# EAGLE schematic SensorStick_IMUedits (EAGLE 9.6.2)
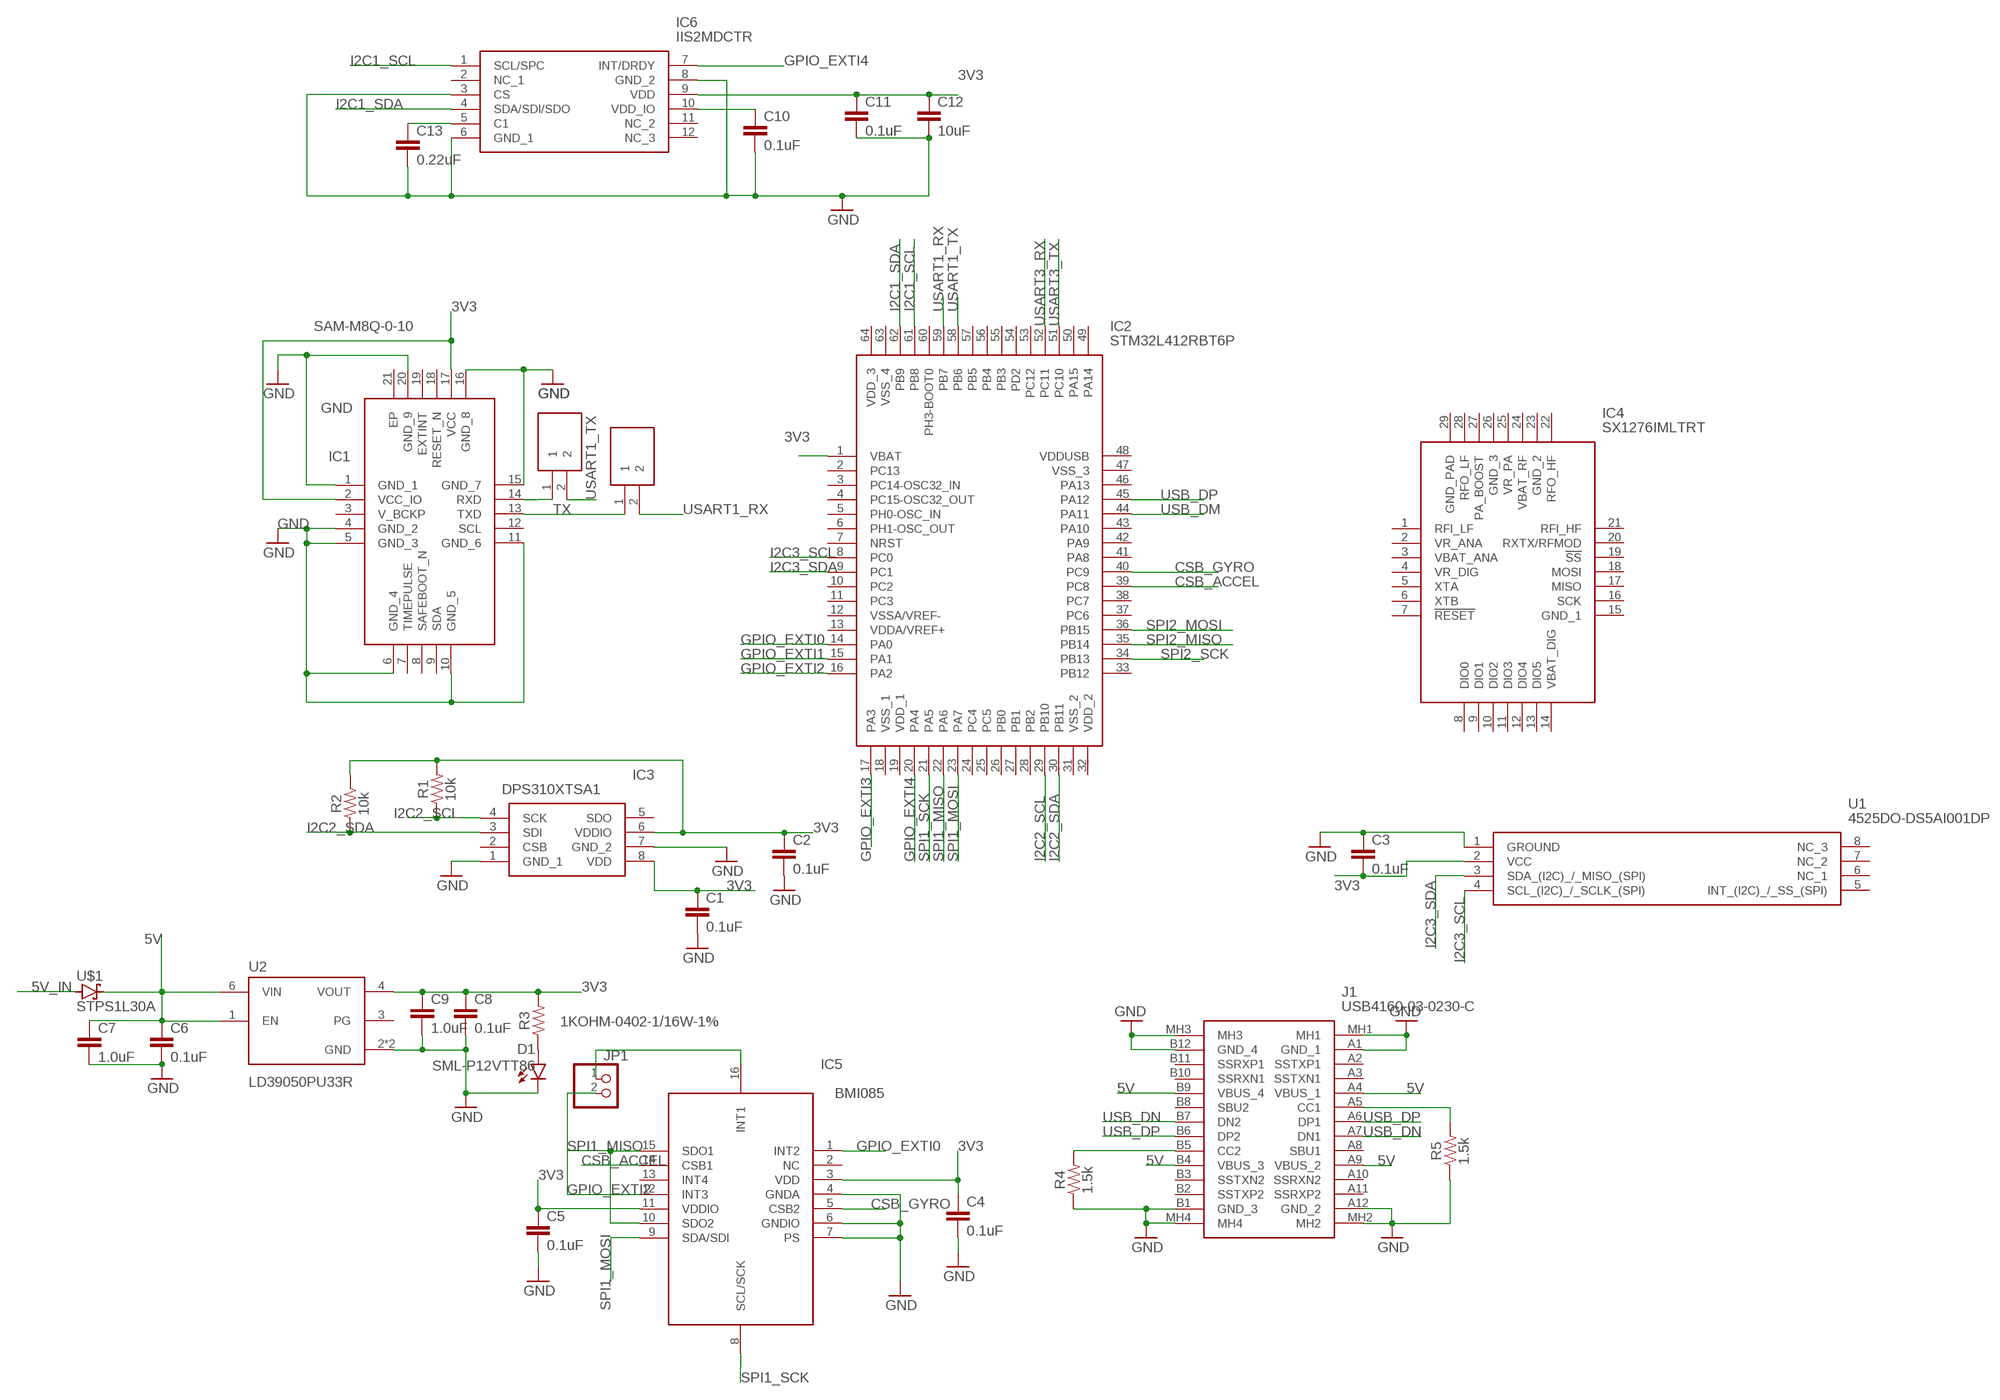
[diagram p0: schematic, sheet 1]

## Parts
C1  0.1uF  0.1UF-0402-6.3V-10%-X7R  [0402]
C2  0.1uF  0.1UF-0402-6.3V-10%-X7R  [0402]
C3  0.1uF  0.1UF-0402-6.3V-10%-X7R  [0402]
C4  0.1uF  0.1UF-0402-6.3V-10%-X7R  [0402]
C5  0.1uF  0.1UF-0402-6.3V-10%-X7R  [0402]
C6  0.1uF  0.1UF-0402-6.3V-10%-X7R  [0402]
C7  1.0uF  1.0UF-0402-16V-10%  [0402]
C8  0.1uF  0.1UF-0402-6.3V-10%-X7R  [0402]
C9  1.0uF  1.0UF-0402-16V-10%  [0402]
C10  0.1uF  0.1UF-0402-6.3V-10%-X7R  [0402]
C11  0.1uF  0.1UF-0402-6.3V-10%-X7R  [0402]
C12  10uF  10UF-0603-6.3V-20%  [0603]
C13  0.22uF  0.22UF-0603-25V-10%  [0603]
D1  SML-P12VTT86  [LED_SML-P11UTT86R]
FB1  BLM15HD102SN1  [NFZ15SG152SN10B]
FB2  BLM15HD102SN1  [NFZ15SG152SN10B]
IC1  SAM-M8Q-0-10  [SAMM8Q010]
IC2  STM32L412RBT6P  [QFP50P1200X1200X160-64N]
IC3  DPS310XTSA1  [DPS310XTSA1]
IC4  SX1276IMLTRT  [QFN65P600X600X100-29N]
IC5  BMI085  [BMI085]
IC6  IIS2MDCTR  [IIS2MDCTR]
J1  USB4160-03-0230-C  [USB4160030230C]
JP1  PINHD-1X2  [1X02]
R1  10k  10KOHM-0402-1/16W-1%  [0402]
R2  10k  10KOHM-0402-1/16W-1%  [0402]
R3  1KOHM-0402-1/16W-1%  [0402]
R4  1.5k  1.5KOHM-0603-1/10W-1%  [0603]
R5  1.5k  1.5KOHM-0603-1/10W-1%  [0603]
U1  4525DO-DS5AI001DP  [4525DO-DS...P]
U2  LD39050PU33R  [SON95P300X300X100-7N]
U$1  STPS1L30A  [DIOM5226X223N]

## Nets
3V3: C1.1 C2.1 C3.2 C4.1 C5.1 C8.1 C9.1 C11.1 C12.1 IC1.2(VCC_IO) IC1.17(VCC) IC2.1(VBAT) IC3.6(VDDIO) IC3.8(VDD) IC5.3(VDD) IC5.11(VDDIO) IC6.9(VDD) R1.2 R2.2 R3.2 U1.2(VCC) U2.4(VOUT)
5V: C6.1 C7.1 J1.A4(VBUS_1) J1.A9(VBUS_2) J1.B4(VBUS_3) J1.B9(VBUS_4) U2.1(EN) U2.6(VIN) U$1.1(C)
5V_IN: U$1.2(A)
CSB_ACCEL: IC2.39(PC8) IC5.14(CSB1)
CSB_GYRO: IC2.40(PC9) IC5.5(CSB2)
GND: C1.2 C2.2 C3.1 C4.2 C5.2 C6.2 C7.2 C8.2 C9.2 C10.2 C11.2 C12.2 C13.2 D1.C IC1.1(GND_1) IC1.4(GND_2) IC1.5(GND_3) IC1.6(GND_4) IC1.10(GND_5) IC1.11(GND_6) IC1.15(GND_7) IC1.16(GND_8) IC1.20(GND_9) IC3.1(GND_1) IC3.7(GND_2) IC5.4(GNDA) IC5.6(GNDIO) IC5.7(PS) IC6.3(CS) IC6.6(GND_1) IC6.8(GND_2) J1.A1(GND_1) J1.A12(GND_2) J1.B1(GND_3) J1.B12(GND_4) J1.MH1 J1.MH2 J1.MH3 J1.MH4 R4.1 R5.1 U1.1(GROUND) U2.2(GND) U2.7(GND)
GPIO_EXTI0: IC2.14(PA0) IC5.1(INT2)
GPIO_EXTI1: IC2.15(PA1)
GPIO_EXTI2: IC2.16(PA2) IC5.12(INT3) JP1.2
GPIO_EXTI3: IC2.17(PA3)
GPIO_EXTI4: IC2.20(PA4) IC6.7(INT/DRDY)
I2C1_SCL: IC2.61(PB8) IC6.1(SCL/SPC)
I2C1_SDA: IC2.62(PB9) IC6.4(SDA/SDI/SDO)
I2C2_SCL: IC2.29(PB10) IC3.4(SCK) R1.1
I2C2_SDA: IC2.30(PB11) IC3.3(SDI) R2.1
I2C3_SCL: IC2.8(PC0) U1.4(SCL_(I2C)_/_SCLK_(SPI))
I2C3_SDA: IC2.9(PC1) U1.3(SDA_(I2C)_/_MISO_(SPI))
N$2: FB2.1 IC1.14(RXD)
N$3: J1.A5(CC1) R5.2
N$5: D1.A R3.1
N$6: C10.1 IC6.10(VDD_IO)
N$7: C13.1 IC6.5(C1)
N$9: IC5.16(INT1) JP1.1
N$10: J1.B5(CC2) R4.2
SPI1_MISO: IC2.22(PA6) IC5.10(SDO2) IC5.15(SDO1)
SPI1_MOSI: IC2.23(PA7) IC5.9(SDA/SDI)
SPI1_SCK: IC2.21(PA5) IC5.8(SCL/SCK)
SPI2_MISO: IC2.35(PB14)
SPI2_MOSI: IC2.36(PB15)
SPI2_SCK: IC2.34(PB13)
TX: FB1.1 IC1.13(TXD)
USART1_RX: FB1.2 IC2.59(PB7)
USART1_TX: FB2.2 IC2.58(PB6)
USART3_RX: IC2.52(PC11)
USART3_TX: IC2.51(PC10)
USB_DM: IC2.44(PA11)
USB_DN: J1.A7(DN1) J1.B7(DN2)
USB_DP: IC2.45(PA12) J1.A6(DP1) J1.B6(DP2)
Unconnected: IC1.3(V_BCKP) IC1.7(TIMEPULSE) IC1.8(SAFEBOOT_N) IC1.9(SDA) IC1.12(SCL) IC1.18(RESET_N) IC1.19(EXTINT) IC1.21(EP) IC2.2(PC13) IC2.3(PC14-OSC32_IN) IC2.4(PC15-OSC32_OUT) IC2.5(PH0-OSC_IN) IC2.6(PH1-OSC_OUT) IC2.7(NRST) IC2.10(PC2) IC2.11(PC3) IC2.12(VSSA/VREF-) IC2.13(VDDA/VREF+) IC2.18(VSS_1) IC2.19(VDD_1) IC2.24(PC4) IC2.25(PC5) IC2.26(PB0) IC2.27(PB1) IC2.28(PB2) IC2.31(VSS_2) IC2.32(VDD_2) IC2.33(PB12) IC2.37(PC6) IC2.38(PC7) IC2.41(PA8) IC2.42(PA9) IC2.43(PA10) IC2.46(PA13) IC2.47(VSS_3) IC2.48(VDDUSB) IC2.49(PA14) IC2.50(PA15) IC2.53(PC12) IC2.54(PD2) IC2.55(PB3) IC2.56(PB4) IC2.57(PB5) IC2.60(PH3-BOOT0) IC2.63(VSS_4) IC2.64(VDD_3) IC3.2(CSB) IC3.5(SDO) IC4.1(RFI_LF) IC4.2(VR_ANA) IC4.3(VBAT_ANA) IC4.4(VR_DIG) IC4.5(XTA) IC4.6(XTB) IC4.7(!RESET) IC4.8(DIO0) IC4.9(DIO1) IC4.10(DIO2) IC4.11(DIO3) IC4.12(DIO4) IC4.13(DIO5) IC4.14(VBAT_DIG) IC4.15(GND_1) IC4.16(SCK) IC4.17(MISO) IC4.18(MOSI) IC4.19(!SS) IC4.20(RXTX/RFMOD) IC4.21(RFI_HF) IC4.22(RFO_HF) IC4.23(GND_2) IC4.24(VBAT_RF) IC4.25(VR_PA) IC4.26(GND_3) IC4.27(PA_BOOST) IC4.28(RFO_LF) IC4.29(GND_PAD) IC5.2(NC) IC5.13(INT4) IC6.2(NC_1) IC6.11(NC_2) IC6.12(NC_3) J1.A2(SSTXP1) J1.A3(SSTXN1) J1.A8(SBU1) J1.A10(SSRXN2) J1.A11(SSRXP2) J1.B2(SSTXP2) J1.B3(SSTXN2) J1.B8(SBU2) J1.B10(SSRXN1) J1.B11(SSRXP1) U1.5(INT_(I2C)_/_SS_(SPI)) U1.6(NC_1) U1.7(NC_2) U1.8(NC_3) U2.3(PG)

## Library data of the parts
C1-C6 C8 C10 C11 = SparkFun-Capacitors:0.1UF: 0.1µF ceramic capacitors A capacitor is a passive two-terminal electrical component used to store electrical energy temporarily in an electric field.; PROD_ID: CAP-14993
C7 C9 = SparkFun-Capacitors:1.0UF: 1µF ceramic capacitors A capacitor is a passive two-terminal electrical component used to store electrical energy temporarily in an electric field.; PROD_ID: CAP-12417
C12 = SparkFun-Capacitors:10UF: 10.0µF ceramic capacitors A capacitor is a passive two-terminal electrical component used to store electrical energy temporarily in an electric field.; PROD_ID: CAP-11015
C13 = SparkFun-Capacitors:0.22UF: 0.22µF ceramic capacitors A capacitor is a passive two-terminal electrical component used to store electrical energy temporarily in an electric field.; PROD_ID: CAP-07822
D1 = ce-capstone:SML-P12VTT86: SML-P1 Series Red 0402 Clear 60 mcd 2 V Surface Mount PICOLED LED; AVAILABILITY: Unavailable; DESCRIPTION: Red 630nm LED Indication - Discrete 2V 0402 _1006 Metric_; MF: Rohm; MP: SML-P12VTT86; PACKAGE: 0402 Rohm; PRICE: None
FB1 FB2 = BLM15HD102SN1:BLM15HD102SN1: Ferrite Beads Source: Datasheet <http://www.murata.com/~/media/webrenewal/support/library/catalog/products/emc/emifil/c31e.ashx?la=en-gb>; DESCRIPTION: Ferrite Beads; HEIGHT: 0.55mm; MANUFACTURER_NAME: Murata Electronics; MANUFACTURER_PART_NUMBER: BLM15HD102SN1; MOUSER_PART_NUMBER: N/A; MOUSER_PRICE-STOCK: https://www.mouser.co.uk/ProductDetail/Murata-Electronics/BLM15HD102SN1?qs=%2F7R%2FnUXKGoiRMnYJExxoAg%3D%3D
IC1 = SAM-M8Q-0-10:SAM-M8Q-0-10: GNSS antenna module Source: Datasheet <https://www.u-blox.com/sites/default/files/SAM-M8Q_DataSheet_(UBX-16012619).pdf>; DESCRIPTION: GNSS antenna module; HEIGHT: 3mm; MANUFACTURER_NAME: U-Blox; MANUFACTURER_PART_NUMBER: SAM-M8Q-0-10; MOUSER_PART_NUMBER: N/A; MOUSER_PRICE-STOCK: https://www.mouser.co.uk/ProductDetail/u-blox/SAM-M8Q-0-10?qs=KUoIvG%2F9IlYKGQbFkOKljQ%3D%3D
IC2 = STM32L412RBT6P:STM32L412RBT6P: ARM Microcontrollers - MCU Source: Datasheet <https://www.st.com/resource/en/datasheet/stm32l412c8.pdf>; DESCRIPTION: ARM Microcontrollers - MCU; HEIGHT: 1.6mm; MANUFACTURER_NAME: STMicroelectronics; MANUFACTURER_PART_NUMBER: STM32L412RBT6P; MOUSER_PART_NUMBER: 511-STM32L412RBT6P; MOUSER_PRICE-STOCK: https://www.mouser.co.uk/ProductDetail/STMicroelectronics/STM32L412RBT6P?qs=l7cgNqFNU1hh%252BU1wOZs5Xg%3D%3D
IC3 = DPS310XTSA1:DPS310XTSA1: INFINEON - DPS310XTSA1 - DIGITAL PRESSURE SENSOR, 1200HPA, VLGA-8 Source: Datasheet <https://www.infineon.com/dgdl/Infineon-DPS310-DS-v01_00-EN.pdf?fileId=5546d462576f34750157750826c42242>; ARROW_PART_NUMBER: DPS310XTSA1; ARROW_PRICE-STOCK: https://www.arrow.com/en/products/dps310xtsa1/infineon-technologies-ag?region=nac; DESCRIPTION: INFINEON - DPS310XTSA1 - DIGITAL PRESSURE SENSOR, 1200HPA, VLGA-8; HEIGHT: 1.01mm; MANUFACTURER_NAME: Infineon; MANUFACTURER_PART_NUMBER: DPS310XTSA1; MOUSER_PART_NUMBER: 726-DPS310XTSA1; MOUSER_PRICE-STOCK: https://www.mouser.co.uk/ProductDetail/Infineon-Technologies/DPS310XTSA1?qs=uuTTuBTXn66Ynca8WHwycg%3D%3D
IC4 = SX1276IMLTRT:SX1276IMLTRT: RF Transceiver SINGLE CHIP 3 BANDS TRANCEIVER Source: Datasheet <https://componentsearchengine.com/Datasheets/1/SX1276IMLTRT.pdf>; ARROW_PART_NUMBER: SX1276IMLTRT; ARROW_PRICE-STOCK: https://www.arrow.com/en/products/sx1276imltrt/semtech?region=europe; DESCRIPTION: RF Transceiver SINGLE CHIP 3 BANDS TRANCEIVER; HEIGHT: 1mm; MANUFACTURER_NAME: SEMTECH; MANUFACTURER_PART_NUMBER: SX1276IMLTRT; MOUSER_PART_NUMBER: 947-SX1276IMLTRT; MOUSER_PRICE-STOCK: https://www.mouser.co.uk/ProductDetail/Semtech/SX1276IMLTRT?qs=rBWM4%252BvDhIceYQoeMKd%2FQQ%3D%3D
IC5 = BMI085:BMI085: IMUs - Inertial Measurement Units High-performance IMU BMI085 for virtual and augmented reality applications Source: Datasheet <https://ae-bst.resource.bosch.com/media/_tech/media/datasheets/BST-BMI085-DS001.pdf>; ARROW_PART_NUMBER: BMI085; ARROW_PRICE-STOCK: https://www.arrow.com/en/products/bmi085/bosch; DESCRIPTION: IMUs - Inertial Measurement Units High-performance IMU BMI085 for virtual and augmented reality applications; HEIGHT: 1mm; MANUFACTURER_NAME: Bosch Sensortec; MANUFACTURER_PART_NUMBER: BMI085; MOUSER_PART_NUMBER: 262-BMI085; MOUSER_PRICE-STOCK: https://www.mouser.co.uk/ProductDetail/Bosch-Sensortec/BMI085?qs=y6ZabgHbY%252ByGCM8LfWZyqA%3D%3D
IC6 = IIS2MDCTR:IIS2MDCTR: STMICROELECTRONICS - IIS2MDCTR - MEMS MODULE, 3-AXIS MAGNETOMETER, LGA-12 Source: Datasheet <https://www.st.com/resource/en/datasheet/iis2mdc.pdf>; ARROW_PART_NUMBER: IIS2MDCTR; ARROW_PRICE-STOCK: https://www.arrow.com/en/products/iis2mdctr/stmicroelectronics; DESCRIPTION: STMICROELECTRONICS - IIS2MDCTR - MEMS MODULE, 3-AXIS MAGNETOMETER, LGA-12; HEIGHT: 0.7mm; MANUFACTURER_NAME: STMicroelectronics; MANUFACTURER_PART_NUMBER: IIS2MDCTR; MOUSER_PART_NUMBER: 511-IIS2MDCTR; MOUSER_PRICE-STOCK: https://www.mouser.co.uk/ProductDetail/STMicroelectronics/IIS2MDCTR?qs=1mbolxNpo8ems1K%2FRdQzXg%3D%3D
J1 = USB4160-03-0230-C:USB4160-03-0230-C: USB Connectors USB 3.2 Gen 2 Type C Rec Vert 16P SMT 3 gold 2.3mm TH stakes H= 7.46mm T+R+Cap Source: Datasheet <https://gct.co/files/drawings/usb4160.pdf>; DESCRIPTION: USB Connectors USB 3.2 Gen 2 Type C Rec Vert 16P SMT 3 gold 2.3mm TH stakes H= 7.46mm T+R+Cap; HEIGHT: 7.66mm; MANUFACTURER_NAME: GCT (GLOBAL CONNECTOR TECHNOLOGY); MANUFACTURER_PART_NUMBER: USB4160-03-0230-C; MOUSER_PART_NUMBER: 640-USB4160-3-0230-C; MOUSER_PRICE-STOCK: https://www.mouser.co.uk/ProductDetail/GCT/USB4160-03-0230-C?qs=vvQtp7zwQdPkHEPa2L0V1A%3D%3D
JP1 = pinhead:PINHD-1X2: PIN HEADER
R1 R2 = SparkFun-Resistors:10KOHM: 10kΩ resistor A resistor is a passive two-terminal electrical component that implements electrical resistance as a circuit element. Resistors act to reduce current flow, and, at the same time, act to lower voltage levels within circuits. - Wikipedia; PROD_ID: RES-14241
R3 = SparkFun-Resistors:1KOHM: 1kΩ resistor A resistor is a passive two-terminal electrical component that implements electrical resistance as a circuit element. Resistors act to reduce current flow, and, at the same time, act to lower voltage levels within circuits. - Wikipedia; PROD_ID: RES-14342
R4 R5 = SparkFun-Resistors:1.5KOHM: 1.5kΩ resistor A resistor is a passive two-terminal electrical component that implements electrical resistance as a circuit element. Resistors act to reduce current flow, and, at the same time, act to lower voltage levels within circuits. - Wikipedia; PROD_ID: RES-08306
U1 = 4525DO-DS5AI001DP:4525DO-DS5AI001DP: Differential Pressure Sensor 1PSI Dual Barbs Source: Datasheet <http://www.te.com/commerce/DocumentDelivery/DDEController?Action=srchrtrv&DocNm=MS4525DO&DocType=DS&DocLang=English>; ARROW_PART_NUMBER: 4525DO-DS5AI001DP; ARROW_PRICE-STOCK: https://www.arrow.com/en/products/4525do-ds5ai001dp/te-connectivity; DESCRIPTION: Differential Pressure Sensor 1PSI Dual Barbs; HEIGHT: mm; MANUFACTURER_NAME: TE Connectivity; MANUFACTURER_PART_NUMBER: 4525DO-DS5AI001DP; MOUSER_PART_NUMBER: 824-4525DODS5AI001DP; MOUSER_PRICE-STOCK: https://www.mouser.co.uk/ProductDetail/Measurement-Specialties/4525DO-DS5AI001DP?qs=oFx6pF86PmDUpUCTX7loEA%3D%3D
U2 = ce-capstone:LD39050PU33R: LD39050 Series 500 mA 3.3 V Fixed Low Noise LDO Voltage Regulator - DFN-6; AVAILABILITY: Unavailable; DESCRIPTION: Linear Voltage Regulator IC 1 Output 500mA 6-DFN _3x3_; MF: STMicroelectronics; MP: LD39050PU33R; PACKAGE: DFN-6 STMicroelectronics; PRICE: None
U$1 = ce-capstone:STPS1L30A